# EAGLE design H_Bridge_eagle (EAGLE 9.6.1)
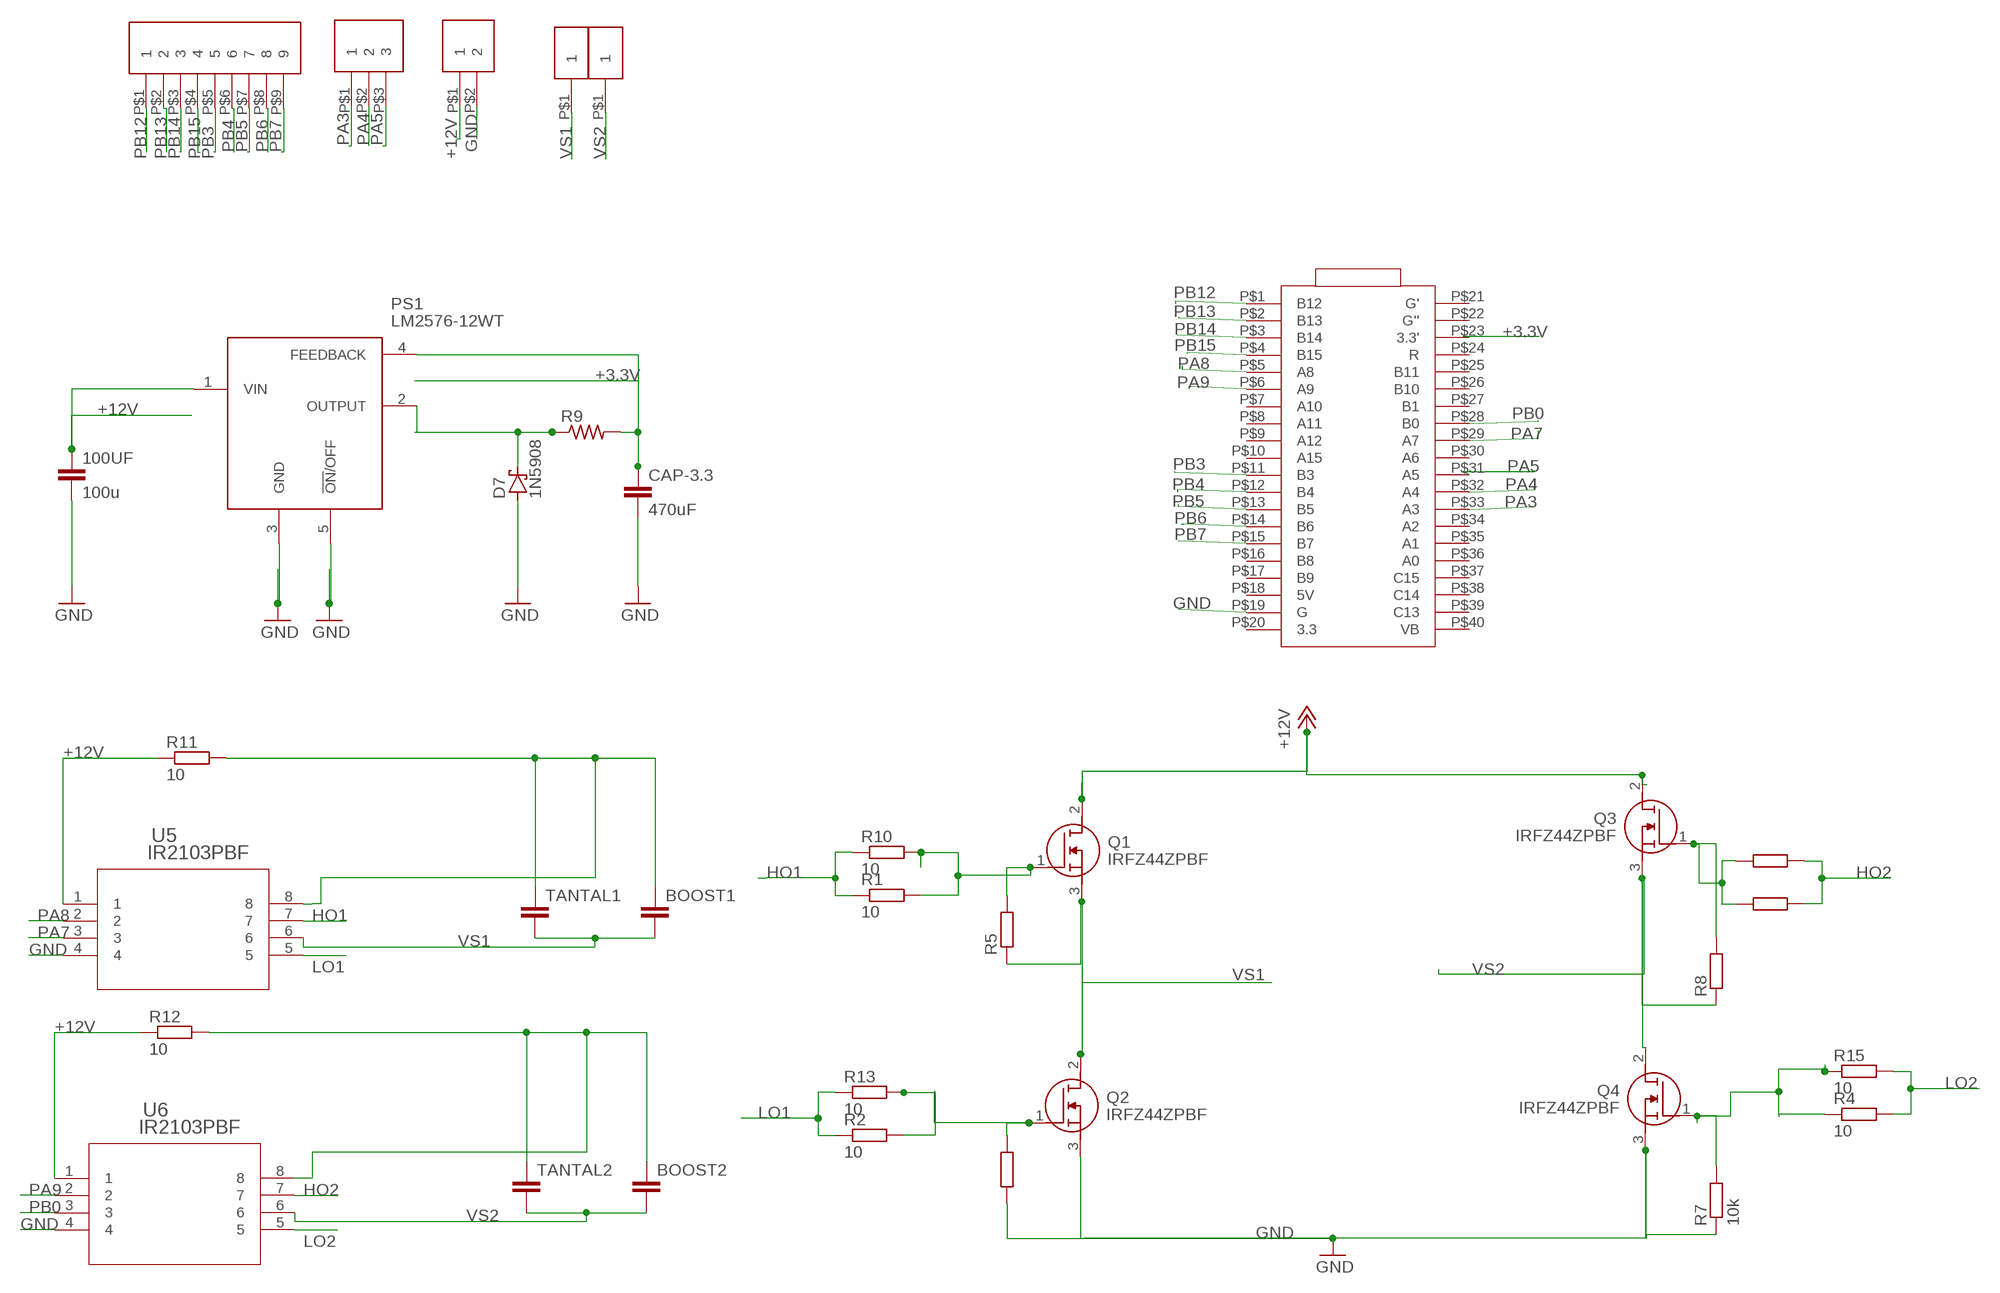
[diagram p0: schematic, sheet 1]

## Parts
100UF  100u  C5/5  [C5B5]
BOOST1  C-EU025-040X050  [C025-040X050]
BOOST2  C-EU025-040X050  [C025-040X050]
CAP-3.3  470uF  C-EU050-075X075  [C050-075X075]
D7  1N5908  [C4111-15]
PS1  LM2576-12WT  [TO170P470X1016X1900-5P]
Q1  IRFZ44ZPBF  [TO254P482X1016X2192-3P]
Q2  IRFZ44ZPBF  [TO254P482X1016X2192-3P]
Q3  IRFZ44ZPBF  [TO254P482X1016X2192-3P]
Q4  IRFZ44ZPBF  [TO254P482X1016X2192-3P]
R1  10  R-EU_0204/7  [0204/7]
R2  10  R-EU_0204/7  [0204/7]
R3  10  R-EU_0204/7  [0204/7]
R4  10  R-EU_0204/7  [0204/7]
R5  10k  R-EU_0204/7  [0204/7]
R6  10k  R-EU_0204/7  [0204/7]
R7  10k  R-EU_0204/7  [0204/7]
R8  10k  R-EU_0204/7  [0204/7]
R9  R-US_VTA55  [VTA55]
R10  10  R-EU_0204/7  [0204/7]
R11  10  R-EU_0204/7  [0204/7]
R12  10  R-EU_0204/7  [0204/7]
R13  10  R-EU_0204/7  [0204/7]
R14  10  R-EU_0204/7  [0204/7]
R15  10  R-EU_0204/7  [0204/7]
TANTAL1  C-EU025-024X044  [C025-024X044]
TANTAL2  C-EU025-024X044  [C025-024X044]
U5  IR2103PBF  [IC8_IR2103PBF_INF]
U6  IR2103PBF  [IC8_IR2103PBF_INF]
U$1  BLUE_PILL_EA  [BLUE_PILL_FOOT]
U$2  HEADER_9  [HEADER_9_FOOT]
U$3  HEADER_3  [HEADER_3_FOOT]
U$4  HEADER_2  [HEADER_2_FOOT]
U$5  HEADER_1  [HEADER_1_FOOT]
U$6  HEADER_1  [HEADER_1_FOOT]

## Nets
+3.3V: CAP-3.3.1 PS1.4(FEEDBACK) R9.2 U$1.P$23(3.3')
+12V: 100UF.1 PS1.1(VIN) Q1.2(D) Q3.2(D) R11.1 R12.1 U5.1 U6.1 U$4.P$1
GND: 100UF.2 CAP-3.3.2 D7.A PS1.3(GND) PS1.5(!ON!/OFF) Q2.3(S) Q4.3(S) R6.1 R7.1 U5.4 U6.4 U$1.P$19(G) U$4.P$2
HO1: R1.1 R10.1 U5.7
HO2: R3.2 R14.2 U6.7
LO1: R2.1 R13.1 U5.5
LO2: R4.2 R15.2 U6.5
N$1: BOOST2.1 R12.2 TANTAL2.1 U6.8
N$2: BOOST1.1 R11.2 TANTAL1.1 U5.8
N$3: D7.C PS1.2(OUTPUT) R9.1
N$4: Q4.1(G) R4.1 R7.2 R15.1
N$6: Q3.1(G) R3.1 R8.2 R14.1
N$7: Q1.1(G) R1.2 R5.2 R10.2
N$8: Q2.1(G) R2.2 R6.2 R13.2
PA3: U$1.P$33(A3) U$3.P$1
PA4: U$1.P$32(A4) U$3.P$2
PA5: U$1.P$31(A5) U$3.P$3
PA7: U5.3 U$1.P$29(A7)
PA8: U5.2 U$1.P$5(A8)
PA9: U6.2 U$1.P$6(A9)
PB0: U6.3 U$1.P$28(B0)
PB3: U$1.P$11(B3) U$2.P$5
PB4: U$1.P$12(B4) U$2.P$6
PB5: U$1.P$13(B5) U$2.P$7
PB6: U$1.P$14(B6) U$2.P$8
PB7: U$1.P$15(B7) U$2.P$9
PB12: U$1.P$1(B12) U$2.P$1
PB13: U$1.P$2(B13) U$2.P$2
PB14: U$1.P$3(B14) U$2.P$3
PB15: U$1.P$4(B15) U$2.P$4
VS1: BOOST1.2 Q1.3(S) Q2.2(D) R5.1 TANTAL1.2 U5.6 U$5.P$1
VS2: BOOST2.2 Q3.3(S) Q4.2(D) R8.1 TANTAL2.2 U6.6 U$6.P$1
Unconnected: U$1.P$7(A10) U$1.P$8(A11) U$1.P$9(A12) U$1.P$10(A15) U$1.P$16(B8) U$1.P$17(B9) U$1.P$18(5V) U$1.P$20(3.3) U$1.P$21(G') U$1.P$22(G'') U$1.P$24(R) U$1.P$25(B11) U$1.P$26(B10) U$1.P$27(B1) U$1.P$30(A6) U$1.P$34(A2) U$1.P$35(A1) U$1.P$36(A0) U$1.P$37(C15) U$1.P$38(C14) U$1.P$39(C13) U$1.P$40(VB)

## Library data of the parts
100UF = capacitor-wima:C: CAPACITOR naming: grid - package width
BOOST1 BOOST2 CAP-3.3 TANTAL1 TANTAL2 = rcl:C-EU: CAPACITOR, European symbol; SPICEPREFIX: C
D7 = diode:1N5908: DIODE schottky
PS1 = SamacSys_Parts:LM2576-12WT: MICROCHIP - LM2576-12WT - DC/DC CONV, BUCK, 52KHZ, TO-220-5 Source: Datasheet <http://ww1.microchip.com/downloads/en/DeviceDoc/lm2576.pdf>; DESCRIPTION: MICROCHIP - LM2576-12WT - DC/DC CONV, BUCK, 52KHZ, TO-220-5; HEIGHT: 4.7mm; MANUFACTURER_NAME: Microchip; MANUFACTURER_PART_NUMBER: LM2576-12WT; MOUSER_PART_NUMBER: 998-LM2576-12WT; MOUSER_PRICE-STOCK: https://www.mouser.com/Search/Refine.aspx?Keyword=998-LM2576-12WT; RS_PART_NUMBER: 1771883; RS_PRICE-STOCK: http://uk.rs-online.com/web/p/products/1771883
Q1-Q4 = IRFZ44ZPBF:IRFZ44ZPBF: MOSFET N-Channel 55V 51A HEXFET TO220AB Infineon IRFZ44ZPBF N-channel MOSFET Transistor, 51 A, 55 V, 3-Pin TO-220AB Source: Datasheet <https://www.google.com/url?sa=t&rct=j&q=&esrc=s&source=web&cd=1&cad=rja&uact=8&ved=2ahUKEwialqma1PPlAhVRx4UKHfd6ANMQFjAAegQIABAC&url=https://www.infineon.com/dgdl/irfz44zpbf.pdf?fileId=5546d462533600a40153563b6a15221c&usg=AOvVaw2BFva2Jvm1idj>; ARROW_PART_NUMBER: IRFZ44ZPBF; ARROW_PRICE-STOCK: https://www.arrow.com/en/products/irfz44zpbf/infineon-technologies-ag; DESCRIPTION: MOSFET N-Channel 55V 51A HEXFET TO220AB Infineon IRFZ44ZPBF N-channel MOSFET Transistor, 51 A, 55 V, 3-Pin TO-220AB; HEIGHT: 4.82mm; MANUFACTURER_NAME: Infineon; MANUFACTURER_PART_NUMBER: IRFZ44ZPBF; MOUSER_PART_NUMBER: 942-IRFZ44ZPBF; MOUSER_PRICE-STOCK: https://www.mouser.co.uk/ProductDetail/Infineon-Technologies/IRFZ44ZPBF?qs=9%252BKlkBgLFf0eGUS%2F5zjSZQ%3D%3D
R1-R8 R10-R15 = rcl:R-EU_: RESISTOR, European symbol; SPICEPREFIX: R
R9 = rcl:R-US_: RESISTOR, American symbol; SPICEPREFIX: R
U5 U6 = ir2103:IR2103PBF; BUILT_BY: EMA_Kyle; COPYRIGHT: Copyright (C) 2018 Accelerated Designs. All rights reserved; DATASHEET: https://www.infineon.com/dgdl/ir2103.pdf?fileId=5546d462533600a4015355c7b54b166f; MANUFACTURER_PART_NUMBER: IR2103PBF; SOURCELIBRARY: Infineon_2020-02-18; VENDOR: Infineon
U$1 = blue_pill_ea:BLUE_PILL_EA
U$2 = header:HEADER_9
U$3 = header:HEADER_3
U$4 = header:HEADER_2
U$5 U$6 = header:HEADER_1

## Module POWER
Ports: 

### Library data of the parts

## Board
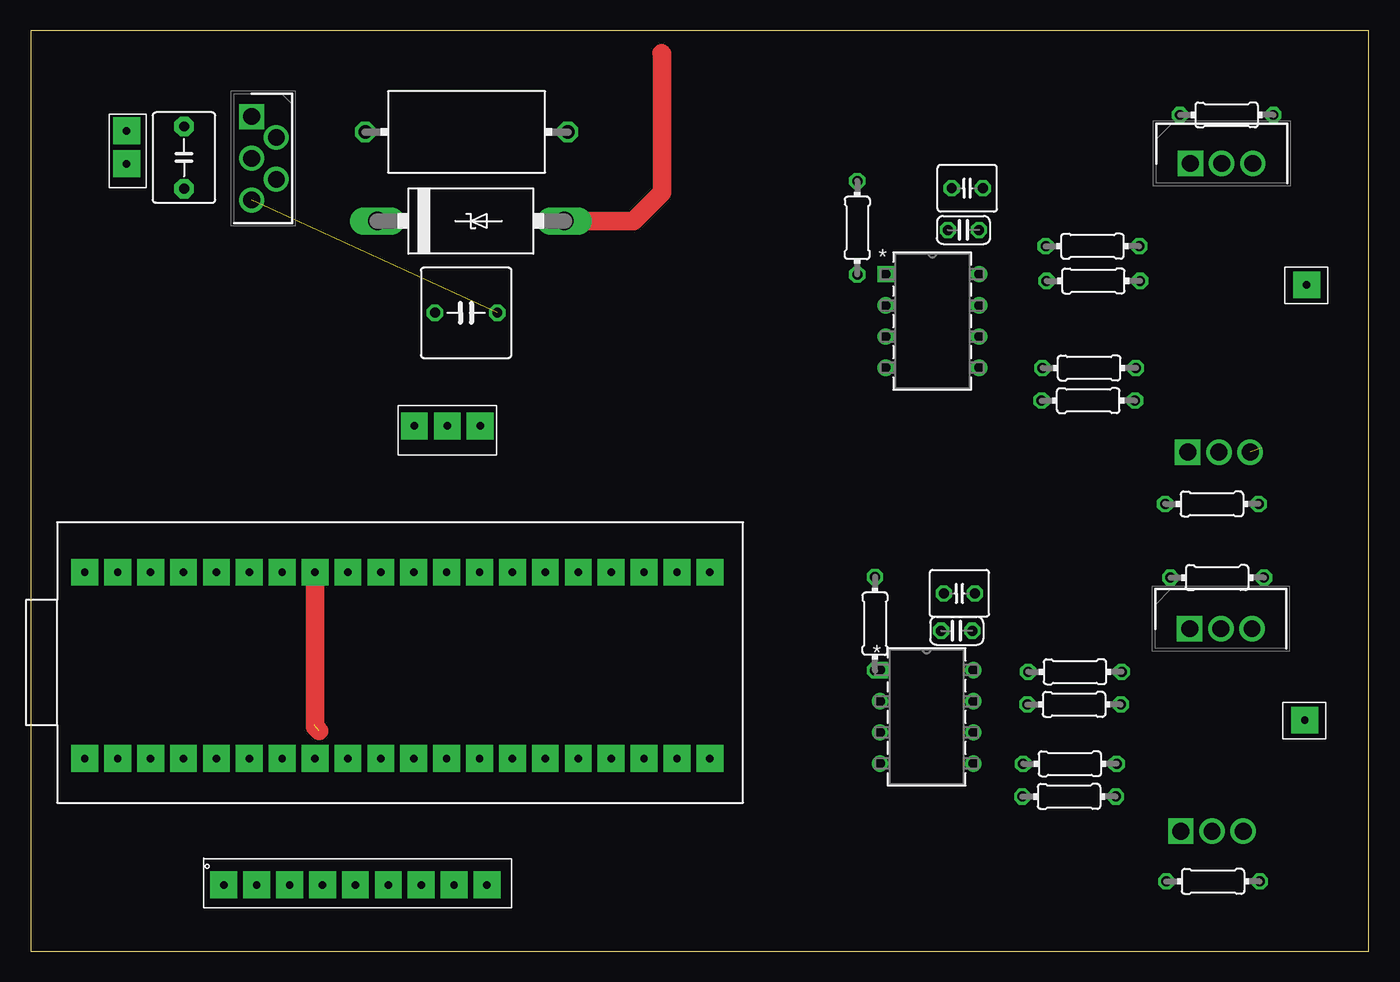
[diagram p1: board, top side]
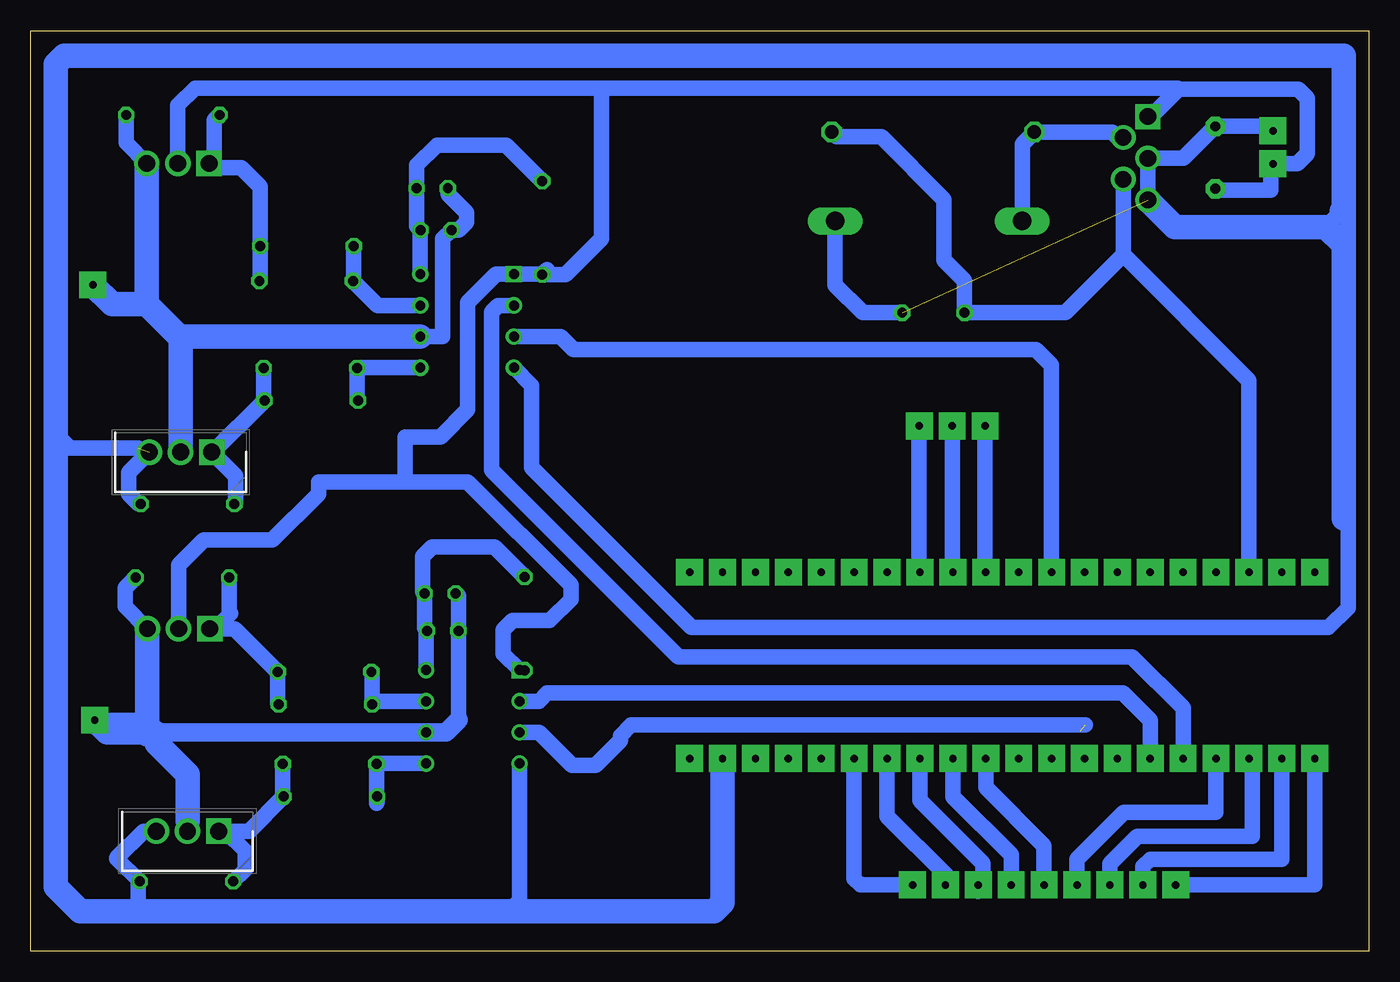
[diagram p2: board, bottom side, seen from below]

Size 109 x 75 mm. Coordinates in mm from the lower left corner, seen from the top.
Outline: 0,0 109,0 109,75 0,75 0,0
Copper layers (1*16): Top 0.035mm / dielectric 1.5mm / Bottom 0.035mm
Design rules "default": minimum track width 6mil, minimum drill 0.35mm, track to track 6mil, track to pad 6mil, pad to pad 6mil, via to via 6mil, smd to smd 6mil, copper to edge 40mil, drill to drill 6mil, minimum pad ring 10mil, minimum via ring 8mil, stop-mask expansion 4mil, vias tented up to drill 0mil, thermal gap 10mil

### Footprints (pad centres in the part's own frame; a part is rotated, then mirrored left to right if it is on the bottom)
C5B5 = drill 0.813 pad 1.6 octagon: 1 -2.54,0; 2 2.54,0
C025-040X050 = drill 0.813 octagon: 1 -1.27,0; 2 1.27,0
C050-075X075 = drill 0.813 octagon: 1 -2.54,0; 2 2.54,0
C4111-15 = drill 1.499 long: A 7.62,0; C -7.62,0
TO170P470X1016X1900-5P = drill 1.35 pad 2.025 square: 1 0,0 | drill 1.35 pad 2.025: 2 1.7,2; 3 3.4,0; 4 5.1,2; 5 6.8,0
TO254P482X1016X2192-3P = drill 1.38 pad 2.07 square: 1 0,0 | drill 1.38 pad 2.07: 2 2.54,0; 3 5.08,0
0204/7 = drill 0.813 octagon: 1 -3.81,0; 2 3.81,0
VTA55 = drill 1.1 octagon: 1 -8.255,0; 2 8.255,0
C025-024X044 = drill 0.813 octagon: 1 -1.27,0; 2 1.27,0
IC8_IR2103PBF_INF = drill 0.813 pad 1.321 square: 1 0,0 | drill 0.813 pad 1.321: 2 0,-2.54; 3 0,-5.08; 4 0,-7.62; 5 7.62,-7.62; 6 7.62,-5.08; 7 7.62,-2.54; 8 7.62,0
BLUE_PILL_FOOT = drill 0.6 pad 2.184 square: P$1 -7.82,21.87; P$2 -7.82,19.19; P$3 -7.82,16.51; P$4 -7.82,13.83; P$5 -7.82,11.15; P$6 -7.82,8.47; P$7 -7.82,5.79; P$8 -7.82,3.11; P$9 -7.82,0.43; P$10 -7.82,-2.25; P$11 -7.82,-4.93; P$12 -7.82,-7.61; P$13 -7.82,-10.29; P$14 -7.82,-12.97; P$15 -7.82,-15.65; P$16 -7.82,-18.33; P$17 -7.82,-21.01; P$18 -7.82,-23.69; P$19 -7.82,-26.37; P$20 -7.82,-29.05; P$21 7.36,21.87; P$22 7.36,19.19; P$23 7.36,16.51; P$24 7.36,13.83; P$25 7.36,11.15; P$26 7.36,8.47; P$27 7.36,5.79; P$28 7.36,3.11; P$29 7.36,0.43; P$30 7.36,-2.25; P$31 7.36,-4.93; P$32 7.36,-7.61; P$33 7.36,-10.29; P$34 7.36,-12.97; P$35 7.36,-15.65; P$36 7.36,-18.33; P$37 7.36,-21.01; P$38 7.36,-23.69; P$39 7.36,-26.37; P$40 7.36,-29.05
HEADER_9_FOOT = drill 0.6 pad 2.184 square: P$1 -1.83,9.17; P$2 -1.83,6.49; P$3 -1.83,3.81; P$4 -1.83,1.13; P$5 -1.83,-1.55; P$6 -1.83,-4.23; P$7 -1.83,-6.91; P$8 -1.83,-9.59; P$9 -1.83,-12.27
HEADER_3_FOOT = drill 0.6 pad 2.184 square: P$1 -1.36,2.68; P$2 -1.36,0; P$3 -1.36,-2.68
HEADER_2_FOOT = drill 0.6 pad 2.184 square: P$1 -0.4,-0.96; P$2 -0.4,-3.64
HEADER_1_FOOT = drill 0.6 pad 2.184 square: P$1 -1.22,0.04

### Placement (x,y rotation side)
100UF  12.49,64.66 90 top
BOOST1  76.29,62.16 180 top
BOOST2  75.65,29.16 180 top
CAP-3.3  35.47,52.02 0 top
D7  35.85,59.5 0 top
PS1  18,68 270 top
Q1  94.47,64.19 0 top
Q2  94.25,40.66 180 bottom
Q3  94.41,26.28 0 top
Q4  93.69,9.78 180 bottom
R1  86.56,54.61 0 top
R2  86.15,44.86 0 top
R3  84.99,20.11 180 top
R4  84.58,12.61 180 top
R5  97.42,68.14 180 top
R6  96.22,36.44 180 top
R7  96.31,5.69 180 top
R8  96.65,30.44 180 top
R9  35.5,66.75 0 top
R10  86.49,57.44 0 top
R11  67.33,58.94 90 top
R12  68.78,26.69 90 top
R13  86.22,47.52 0 top
R14  85.06,22.77 180 top
R15  84.65,15.27 180 top
TANTAL1  75.98,58.76 180 top
TANTAL2  75.43,26.11 180 top
U5  69.64,55.16 0 top
U6  69.17,22.91 0 top
U$1  26.27,23.52 90 top
U$2  24.9,7.24 90 top
U$3  33.94,41.44 270 top
U$4  7.41,63.2 180 top
U$5  105.16,54.25 0 top
U$6  105,18.79 0 top

### Tracks (layer width: path | path; a pad name or v marks a point on that pad's centre or on a via)
+3.3V
  Bottom 1.27: PS1.4 20,56.75 | 20,56.75 24.73,52.02 CAP-3.3.1 32.93,54.65 34.6,56.31 34.6,61.24 39.71,66.36 43.37,66.36 R9.2 | U$1.P$23 9.76,46.51 20,56.75
+12V
  Bottom 1.27: 100UF.1 12.37,62 8,62 8,63.97 U$4.P$1 5.84,64.16 5,65 5,69.5 5.75,70.25 15.5,70.25 | PS1.1 17.75,68 15.5,70.25 | Q1.2 97.01,68.92 95.6,70.32 62.49,70.32 | 62.49,70.32 15.57,70.32 15.5,70.25 | R12.1 69.14,22.88 U6.1 70.5,24.25 70.5,26.16 69.73,26.94 66.74,26.94 65,28.67 65,29.84 73.41,38.24 78.52,38.24 | Q3.2 96.95,31.48 94.93,33.51 89.33,33.51 85.56,37.27 85.56,38.24 78.52,38.24 | 62.49,70.32 62.49,58.05 65.41,55.13 R11.1 66.93,55.53 66.93,55.54 67.31,55.16 U5.1 71.08,55.16 73.4,52.83 73.4,44.13 75.62,41.91 78.52,41.91 78.52,38.24
GND  (2 unrouted)
  Top 1.5: D7.A 49.12,59.5 51.44,61.82 51.44,73.14 51.4,73.18
  Bottom 1.27: U$4.P$2 8.17,67.2 100UF.2 15.09,64.6 PS1.3 PS1.5 | 3.5,59 2.19,60.31 1.69,60.81 | 1.69,60.81 1.69,72.5 2.5,73.31 105.44,73.31 107.31,71.44 107.31,42.5 | 107.31,42.5 105.81,41 100.25,41 | Q2.3 101,38.99 101,37.25 100.19,36.44 R6.1 | Q4.3 99.8,9.78 101.97,7.61 101.97,7.54 R7.1 100.24,5.57 100.24,3.26 | 107.31,42.5 107.31,5.61 104.97,3.26 100.24,3.26 | 100.24,3.26 70.02,3.26 | U6.4 69.17,4.11 70.02,3.26 | CAP-3.3.2 41.21,52.02 43.47,54.28 D7.A | 70.02,3.26 53.33,3.26 | U5.4 68.19,46.09 68.19,39.4 55.16,26.37 3.31,26.37 1.69,27.99 1.69,60.81
  Bottom 2: U$1.P$19 52.64,3.95 53.33,3.26 104.97,3.26 106.95,5.24 106.95,72.26 106.26,72.95 2.05,72.95 2.05,60.45 2.19,60.31 | PS1.5 15.8,59 3.5,59 2.05,57.55 2.05,35.25
HO1
  Bottom 1.27: R10.1 82.68,54.68 R1.1 80.76,52.62 U5.7
HO2
  Bottom 1.27: U6.7 80.92,20.37 R3.2 81.18,22.7 R14.2
LO1
  Bottom 1.27: U5.5 82.39,47.54 R13.1 82.41,44.93 R2.1
LO2
  Bottom 1.27: U6.5 80.82,15.29 R15.2 80.84,12.06 80.83,12.05 80.77,12.12 R4.2
N$1
  Bottom 1.27: R12.2 71.2,32.93 76.3,32.93 77.07,32.15 77.07,29.31 BOOST2.1 76.92,26.33 TANTAL2.1 76.79,26.02 U6.8
N$2
  Bottom 1.27: R11.2 70.27,65.69 75.91,65.69 77.56,64.04 BOOST1.1 77.56,59.07 TANTAL1.1 U5.8
N$3
  Bottom 1.27: D7.C 28.23,65.77 R9.1 20.89,66.75 20.44,66.3 PS1.2
N$4
  Bottom 1.27: R7.2 91.55,6.64 91.55,8.19 93.14,9.78 | 93.14,9.78 Q4.1 | R15.1 88.46,12.68 R4.1 91.22,9.78 93.14,9.78
N$6
  Bottom 1.27: R8.2 92.84,27.65 92.71,27.52 93.94,26.28 | 93.94,26.28 Q3.1 | R3.1 88.87,20.18 R14.1 92.38,26.28 93.94,26.28
N$7
  Bottom 1.27: R5.2 94.06,67.69 94.06,63.85 | 94.06,63.85 94.13,63.85 Q1.1 | R1.2 90.3,54.68 R10.2 90.3,62.31 91.84,63.85 94.06,63.85
N$8
  Bottom 1.27: R6.2 92.32,36.53 92.32,38.73 Q2.1 94.16,40.66 R2.2 90.03,44.93 R13.2
PA3
  Bottom 1.27: U$1.P$33 36.66,30.98 36.66,42.78 U$3.P$1
PA4
  Bottom 1.27: U$3.P$2 33.94,30.94 U$1.P$32
PA5
  Bottom 1.27: U$3.P$3 31.26,30.94 U$1.P$31
PA7
  Bottom 1.27: U$1.P$29 25.84,47.74 27.12,49.02 64.76,49.02 65.83,50.08 U5.3
PA8
  Bottom 1.27: U5.2 70.91,52.62 71.47,52.06 71.47,39.2 56.24,23.97 19.28,23.97 15.12,19.81 U$1.P$5
PA9
  Bottom 1.27: U$1.P$6 17.8,18.82 20.02,21.04 66.93,21.04 67.61,20.37 U6.2
PB0  (1 unrouted)
  Top 1.5: U$1.P$28 23.16,18.3 23.51,17.95
  Bottom 1.27: U6.3 67.59,17.83 64.9,15.15 62.98,15.15 60.95,17.17 60.95,17.56 60.08,18.43 23.11,18.43
PB3
  Bottom 1.27: U$2.P$5 26.45,8.61 31.2,13.36 U$1.P$11
PB4
  Bottom 1.27: U$2.P$6 29.13,7.84 33.88,12.59 U$1.P$12
PB5
  Bottom 1.27: U$1.P$13 36.56,12.32 31.42,7.17 31.42,5.27 31.82,4.87 31.82,5.4 U$2.P$7
PB6
  Bottom 1.27: U$1.P$14 39.24,11 34.37,6.13 34.37,5.53 U$2.P$8
PB7
  Bottom 1.27: U$1.P$15 41.92,5.91 41.42,5.41 U$2.P$9
PB12
  Bottom 1.27: U$1.P$1 4.4,5.41 U$2.P$1
PB13
  Bottom 1.27: U$1.P$2 7.08,7.51 17.8,7.51 18.41,6.9 U$2.P$2
PB14
  Bottom 1.27: U$1.P$3 9.5,15.44 9.5,9.35 18.86,9.35 21.09,7.12 U$2.P$3
PB15
  Bottom 1.27: U$1.P$4 12.44,11.3 19.96,11.3 23.77,7.5 U$2.P$4
VS1
  Bottom 1.27: Q1.3 101.23,65.87 R5.1 | BOOST1.2 75.02,61.7 73.5,60.18 73.5,59.4 74.14,58.76 TANTAL1.2 75.43,58.04 75.43,50.08 U5.6 | 96.79,49.97 96.9,50.08 99.55,52.73
  Bottom 2: Q1.3 99.55,52.73 | U$5.P$1 102.37,52.73 99.55,52.73 | Q2.2 96.79,49.97 99.55,52.73 | 96.9,50.08 U5.6
VS2
  Bottom 1.27: R8.1 101.3,29.6 101.3,28.09 Q3.3 99.49,18.43 | BOOST2.2 74.16,28.94 TANTAL2.2 74.16,18.83 | 99.49,18.43 99.49,17.68 | 96.23,10.61 Q4.2 | 99.49,17.68 98.74,16.93 | U$6.P$1 100.64,18.83 99.49,17.68 | 98.66,17.61 98.89,17.83 99.49,18.43
  Bottom 1.5: 74.16,18.83 75.16,17.83 U6.6 99.34,17.83 99.49,17.68
  Bottom 2: Q3.3 99.49,17.68 | U$6.P$1 102.78,17.83 98.89,17.83 | 98.74,16.93 96.23,14.42 96.23,10.61